# Altium schematic sheet Sheet4.SchDoc
size A4
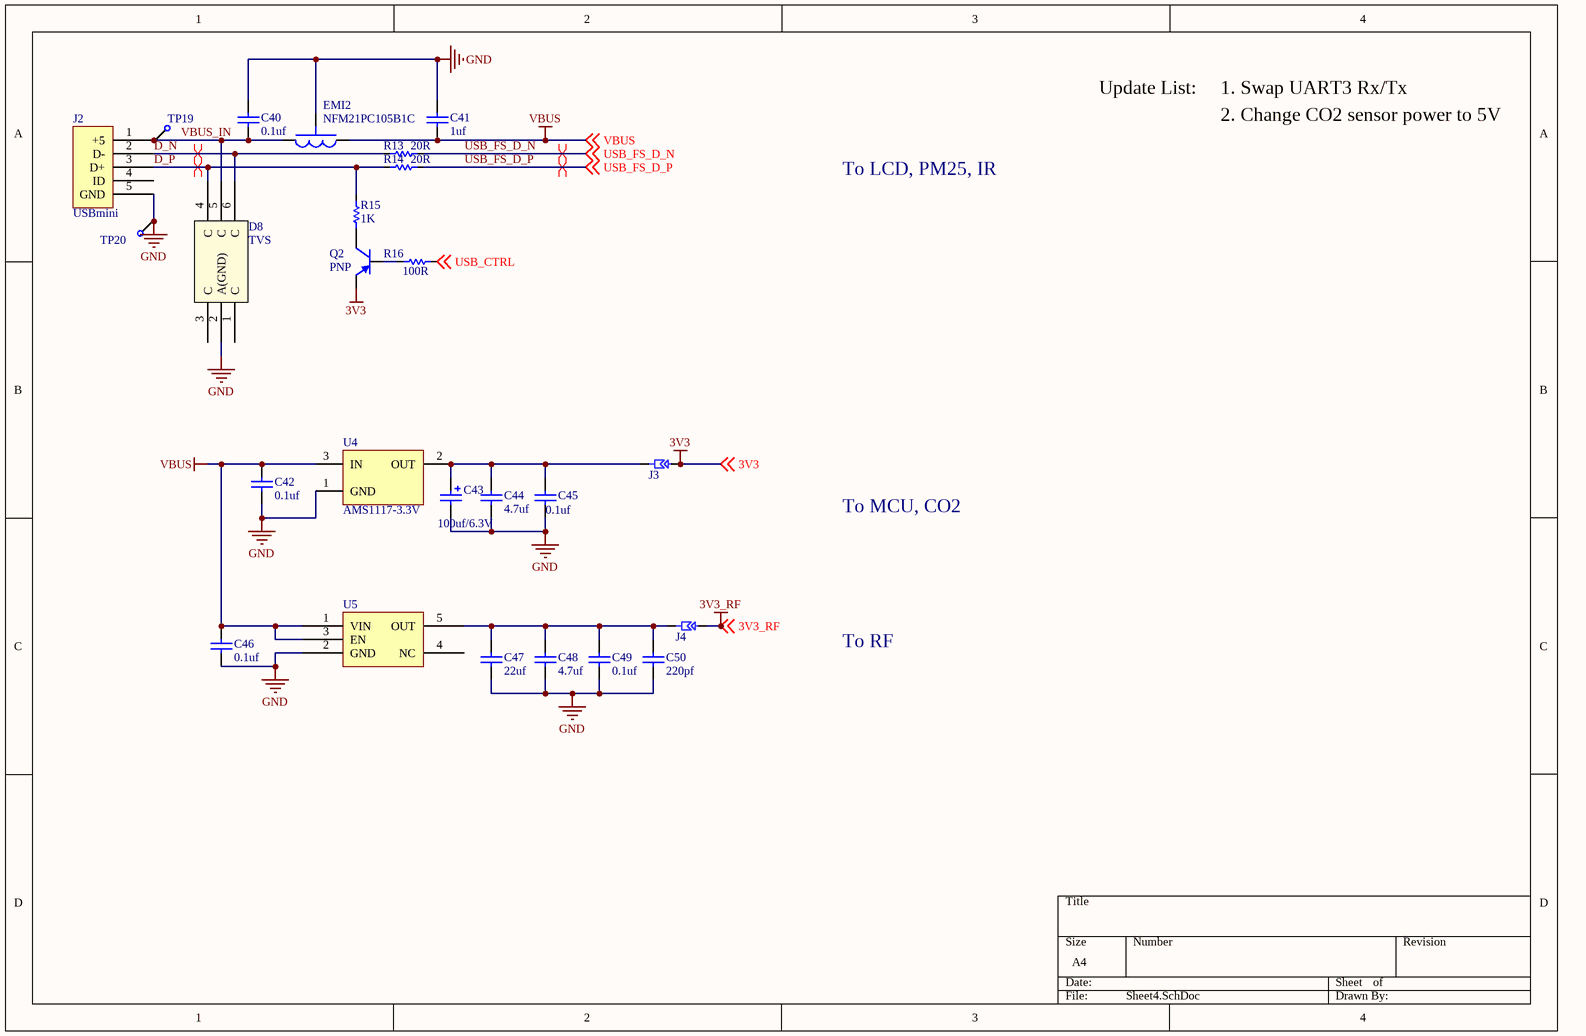
[diagram p0: Sheet4.SchDoc]

## Parts
C40  0.1uf  [C0603]
C41  1uf  [C0603]
C42  0.1uf  [C0603]
C43  value 100uf/6.3V  [C_B型]  (hidden comment: 25V)
C44  4.7uf  [C0805]
C45  0.1uf  [C0603]
C46  0.1uf  [C0603]
C47  22uf  [C1206]
C48  4.7uf  [C0603]
C49  0.1uf  [C0603]
C50  220pf  [C0603]
D8  TVS  [USBLC6-2]
EMI2  NFM21PC105B1C  [NFM21PC]
J2  USBmini  [USB_MICRO_B]
J3  JUMPER  [Jsmall]  (value not drawn)
J4  JUMPER  [Jsmall]  (value not drawn)
Q2  PNP  [SOT23_BJT]
R13  20R  [R0603]
R14  20R  [R0603]
R15  1K  [R0603]
R16  100R  [R0603]
TP19  TestPoint  [TP_0.8]  (value not drawn)
TP20  TestPoint  [TP_0.8]  (value not drawn)
U4  AMS1117-3.3V  [SOT223]
U5  ADP151  [ADP151]  (value not drawn)

## Nets
3V3: J3.2 Q2.1(E) ; off-sheet 3V3
3V3_RF: J4.2 ; off-sheet 3V3_RF
GND: C40.2 C41.2 C42.1 C43.2 C44.1 C45.1 C46.1 C47.1 C48.1 C49.1 C50.1 D8.2(A(GND)) EMI2.2 J2.5(GND) TP20.1 U4.1(GND) U5.2(GND)
VBUS: C41.1 C42.2 C46.2 EMI2.1 U4.3(IN) U5.1(VIN) U5.3(EN) ; off-sheet VBUS
D_N: D8.6(C) J2.2(D-) R13.1
D_P: D8.4(C) J2.3(D+) R14.1 R15.2
USB_CTRL: R16.2 ; off-sheet USB_CTRL
USB_FS_D_N: R13.2 ; off-sheet USB_FS_D_N
USB_FS_D_P: R14.2 ; off-sheet USB_FS_D_P
VBUS_IN: C40.1 D8.5(C) EMI2.3 J2.1(+5) TP19.1
NetC43_1: C43.1 C44.2 C45.2 J3.1 U4.2(OUT)
NetC47_2: C47.2 C48.2 C49.2 C50.2 J4.1 U5.5(OUT)
NetQ2_2: Q2.2(B) R16.1
NetQ2_3: Q2.3(C) R15.1

Not connected (* = marked no-connect by the designer): D8 1(C) 3(C); J2 4(ID); U5 4(NC)

## Layout directives
differential pair: D_N, D_P, USB_FS_D_N, USB_FS_D_P

## Notes on the sheet
- Update List:
- 1. Swap UART3 Rx/Tx
- To LCD, PM25, IR
- 2. Change CO2 sensor power to 5V
- To MCU, CO2
- To RF

## Library data of the parts
C40-C42 C44-C50 = Cap: Capacitor; Option: 25V  X7R
  C40 C42 C45 C46 C49: Value: 0.1uf
  C41: Value: 1uf
  C44 C48: Value: 4.7uf
  C47: Value: 22uf
  C50: Value: 220pf
C43 = Cap+: Polarized Capacitor (Radial); Voltage: 25V
D8 = USBLC6-2
J2 = USB_mini
J3 J4 = J
Q2 = PNP: PNP Bipolar Transistor; Published: 8-Jun-2000; LatestRevisionDate: 17-Jul-2002; LatestRevisionNote: Re-released for DXP Platform.; PackageReference: SOT-23B; Publisher: Altium Limited; Code_JEDEC: SOT-23
R13-R16 = Res: Published: 8-Jun-2000; LatestRevisionDate: 17-Jul-2002; LatestRevisionNote: Re-released for DXP Platform.; PackageReference: AXIAL-0.3; Publisher: Altium Limited
  R13 R14: Value: 20R
  R15: Value: 1K
  R16: Value: 100R
TP19 TP20 = TestPoint: 一个测试点
U4 = 1117: Value: AMS1117-3.3V